# Altium schematic sheet TM16+LED.SchDoc
size A4; SheetNumber: 6; SheetTotal: 6
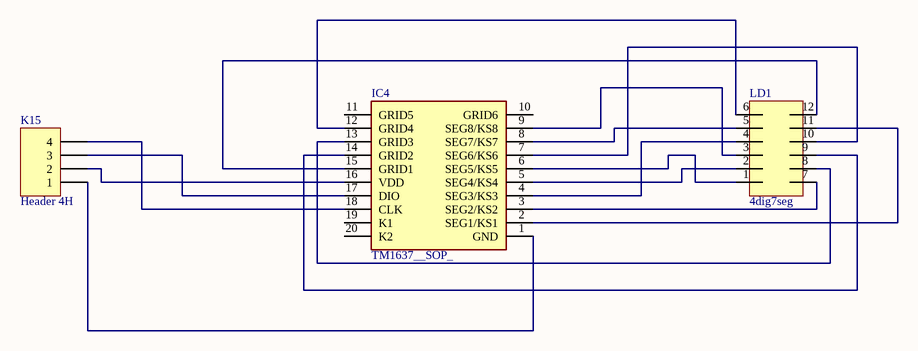
[diagram p0: TM16+LED.SchDoc]

## Parts
IC4  TM1637__SOP_  [SOIC127P1045X280-20N]
K15  Header 4H  [HDR1X4H]
LD1  4dig7seg  [4Digit7seg]

## Nets
NetIC4_1: IC4.1(GND) K15.1
NetIC4_2: IC4.2(SEG1/KS1) LD1.11
NetIC4_3: IC4.3(SEG2/KS2) LD1.7
NetIC4_4: IC4.4(SEG3/KS3) LD1.4
NetIC4_5: IC4.5(SEG4/KS4) LD1.2
NetIC4_6: IC4.6(SEG5/KS5) LD1.1
NetIC4_7: IC4.7(SEG6/KS6) LD1.10
NetIC4_8: IC4.8(SEG7/KS7) LD1.5
NetIC4_9: IC4.9(SEG8/KS8) LD1.3
NetIC4_12: IC4.12(GRID4) LD1.6
NetIC4_13: IC4.13(GRID3) LD1.8
NetIC4_14: IC4.14(GRID2) LD1.9
NetIC4_15: IC4.15(GRID1) LD1.12
NetIC4_16: IC4.16(VDD) K15.2
NetIC4_17: IC4.17(DIO) K15.3
NetIC4_18: IC4.18(CLK) K15.4

Not connected (* = marked no-connect by the designer): IC4 10(GRID6) 11(GRID5) 19(K1) 20(K2)

## Library data of the parts
IC4 = TM1637__SOP_: Integrated Circuit; Manufacturer_Name: TITAN MICRO ELECTRONICS; Manufacturer_Part_Number: TM1637 (SOP); Datasheet Link: https://www.mcielectronics.cl/website_MCI/static/documents/Datasheet_TM1637.pdf; Height: 2.8mm
K15 = Header 4H: Header, 4-Pin, Right Angle; LatestRevisionDate: 17-Jul-2002; LatestRevisionNote: Re-released for DXP Platform.; Publisher: Altium Limited